# EasyEDA schematic SCH_EasyEDA(立创EDA工程文件).json
TITLE: 双光融合热成像; REV: 1.0; Date: 2026-02-11; Sheet: 1/1; Drawn By: umeko & 野生的攻城狮; Company: UmekoLab
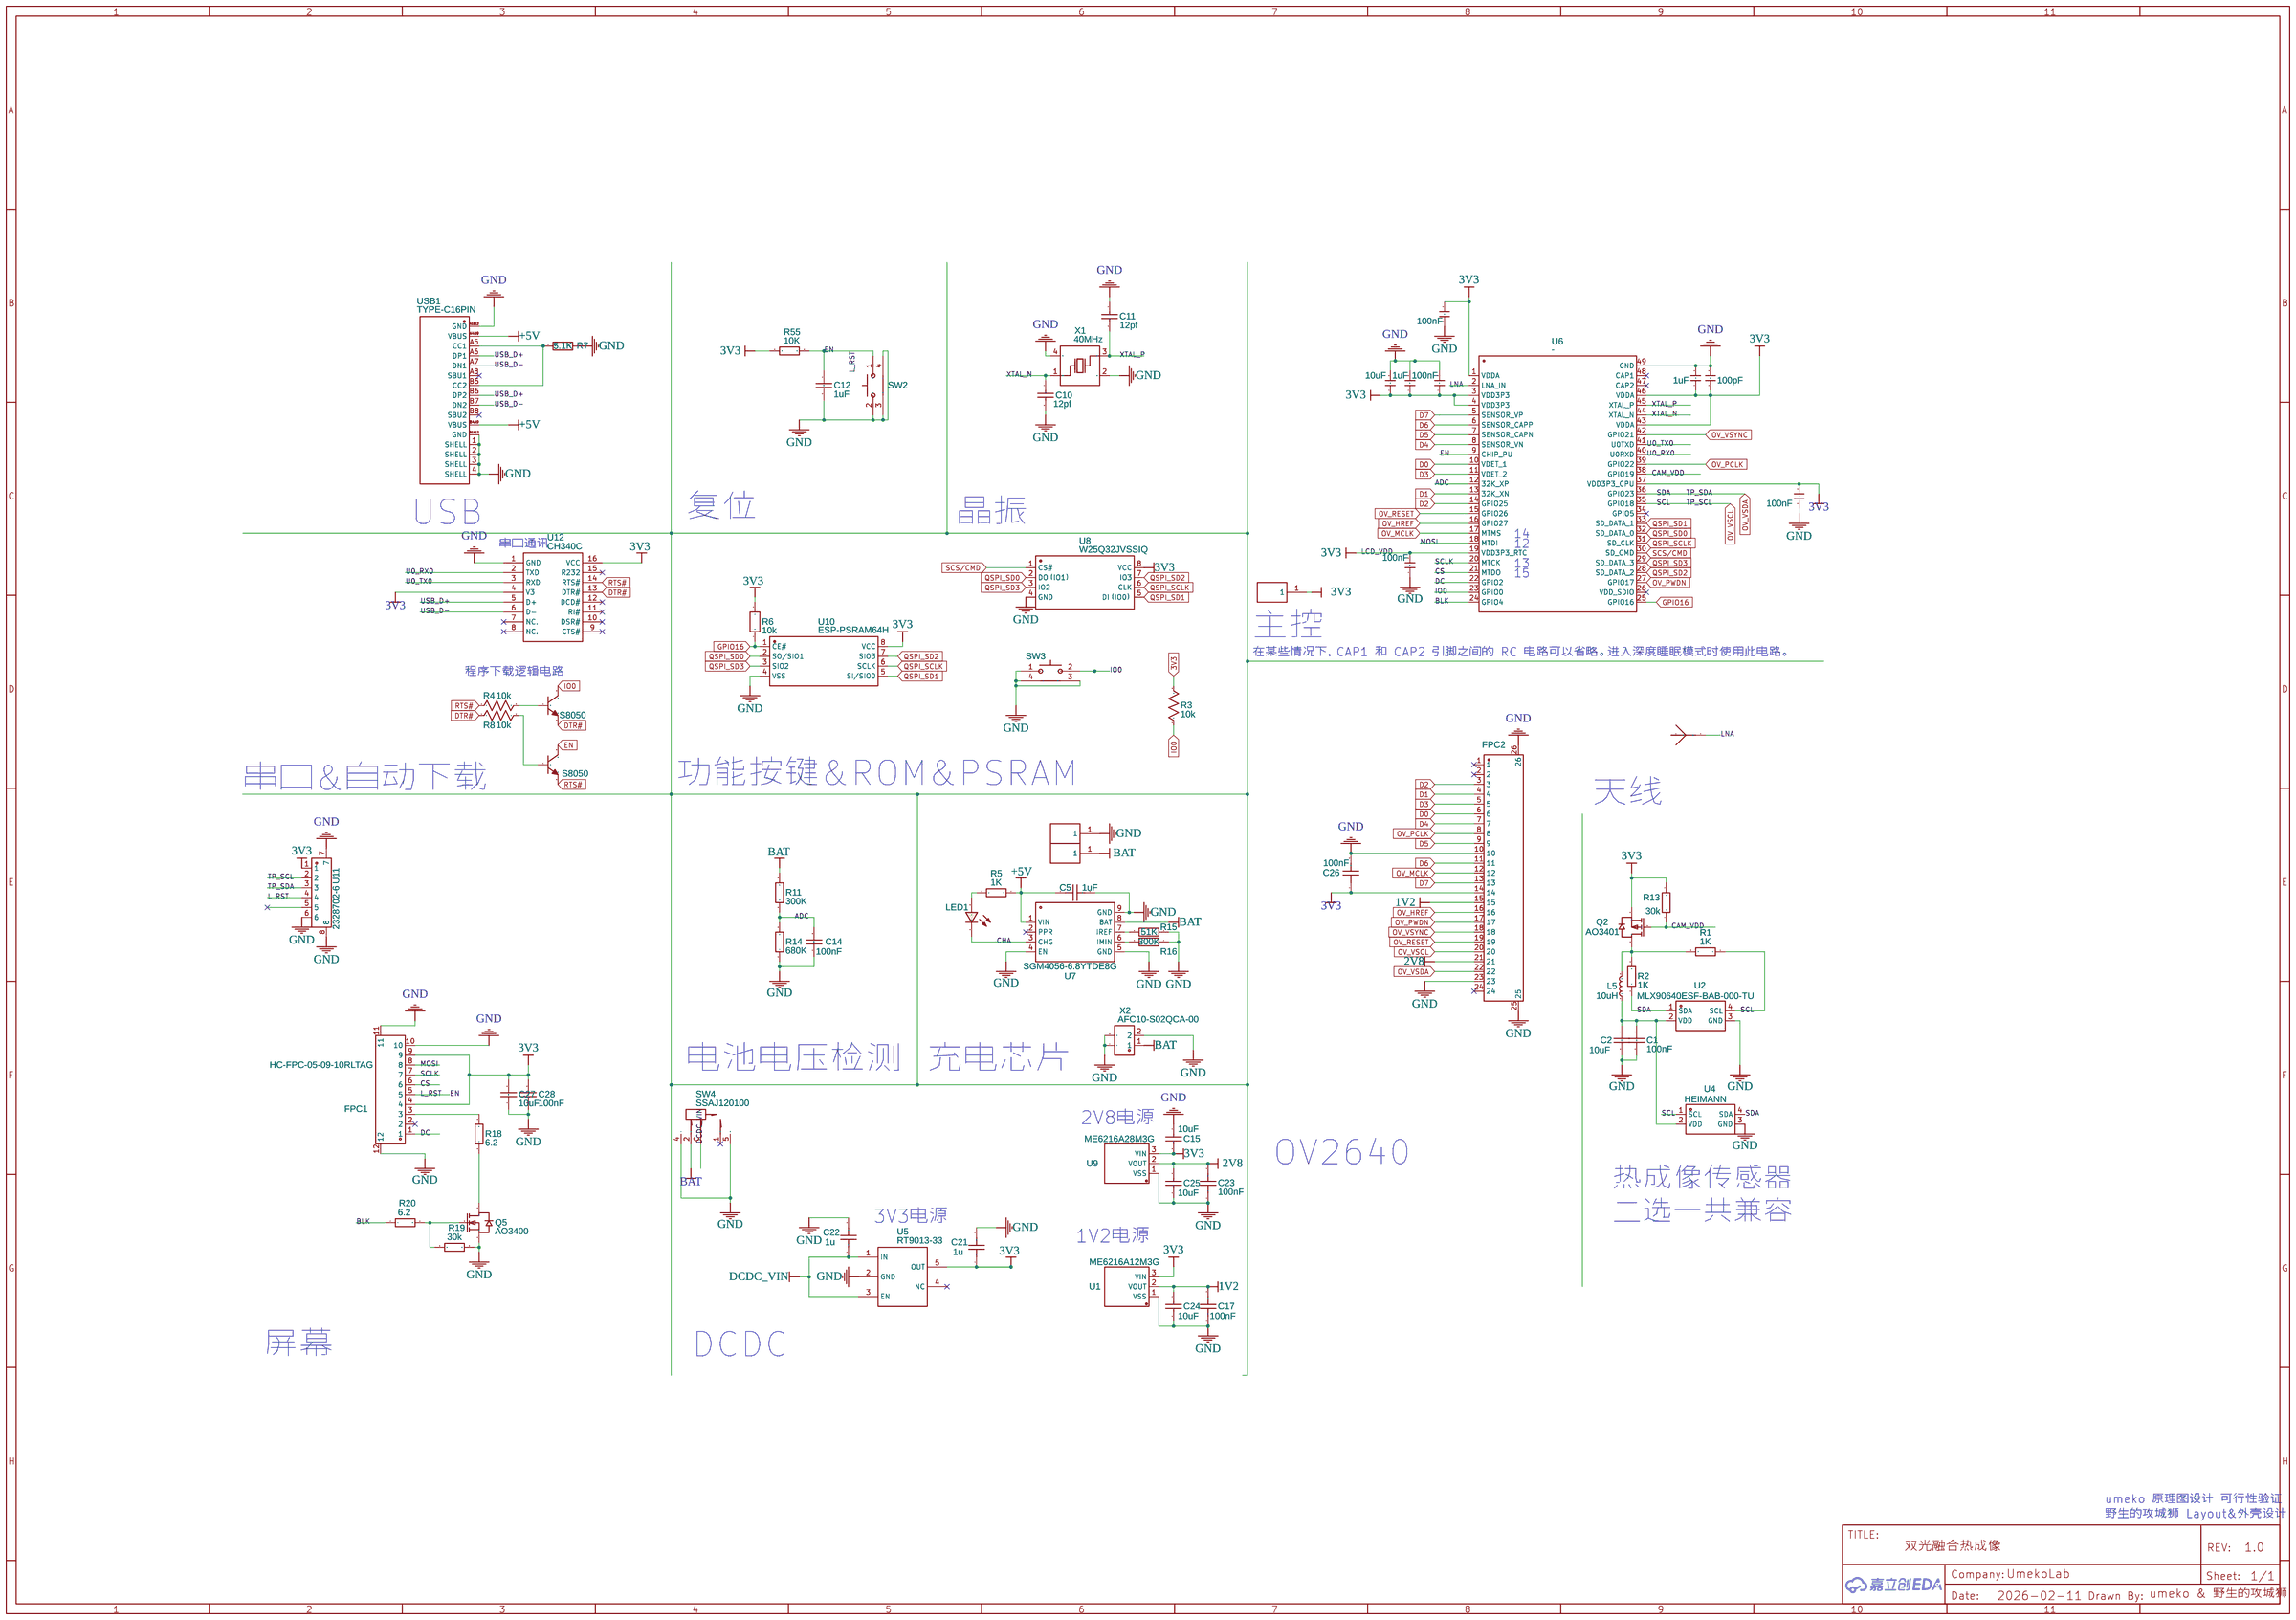
[diagram p0: schematic sheet]

## Parts
C1  100nF  [C0402]
C2  10uF  [C0402]
C5  1uF  [C0402]
C6  1uF  [C0402]
C7  10uF  [C0402]
C8  100nF  [C0402]
C10  12pf  [C0402]
C11  12pf  [C0402]
C12  1uF  [C0402]
C13  100nF  [C0402]
C14  100nF  [C0402]
C15  10uF  [C0402]
C16  1uF  [C0402]
C17  100nF  [C0402]
C18  100pF  [C0402]
C19  100nF  [C0402]
C20  100nF  [C0402]
C21  1u  [C0603]
C22  1u  [C0603]
C23  100nF  [C0402]
C24  10uF  [C0402]
C25  10uF  [C0402]
C26  100nF  [C0402]
C27  10uF  [C0402]
C28  100nF  [C0402]
FPC1  HC-FPC-05-09-10RLTAG  [FPC-SMD_10P-P0.50_HC-FPC-05-09-10RLTAG]
FPC2  AFC24-S24FIA-00  [FPC-SMD_P0.50-24P_QCHF-SM-H2.0]
H1  hp  [HANPAN]
H2  hp  [HANPAN]
H3  hp  [HANPAN]
L2  ANT-PCB-2.4G-IFA-AN043-TI-ORIGIN-X  [ANT-PCB-2.4G-IFA-AN043-TI-ORIGIN]
L5  10uH  [0805-L]
LED1  led-0603  [LED-0603]
Q1  S8050  [SOT-23-3_L2.9-W1.3-P1.90-LS2.4-BR]
Q2  AO3401  [SOT-23-3_L2.9-W1.3-P1.90-LS2.4-BR]
Q4  S8050  [SOT-23-3_L2.9-W1.3-P1.90-LS2.4-BR]
Q5  AO3400  [SOT-23-3_L2.9-W1.4-P1.91-LS2.6-BR]
R1  1K  [R0603]
R2  1K  [R0603]
R3  10k  [R0402]
R4  10k  [R0603]
R5  1K  [R0603]
R6  10k  [R0603]
R7  5.1K  [R0603]
R8  10k  [R0603]
R11  300K  [R0603]
R13  30k  [R0603]
R14  680K  [R0603]
R15  51K  [R0603]
R16  300K  [R0603]
R18  6.2  [R0603]
R19  30k  [R0603]
R20  6.2  [R0603]
R55  10K  [R0603]
SW2  1TS003B  [KEY-SMD_1TS003B]
SW3  1TS003B  [KEY-SMD_1TS003B]
SW4  SSAJ120100  [SW-SMD_SSAJ120100]
U1  ME6216A12M3G  [SOT-23-3_L2.9-W1.6-P1.90-LS2.8-BR]
U2  MLX90640ESF-BAB-000-TU  [TO-39-4_MELEXIS_MLX90640]
U4  HEIMANN  [TO-39-4_MELEXIS_MLX90640]
U5  RT9013-33  [RT9013]
U6  -  [QFN-48_L5.0-W5.0-P0.35-BL-EP3.7]
U7  SGM4056-6.8YTDE8G  [TDFN-8L_L2.0-W2.0-P0.50-BL-EP]
U8  W25Q32JVSSIQ  [SOIC-8_L5.3-W5.3-P1.27-LS8.0-BL]
U9  ME6216A28M3G  [SOT-23-3_L2.9-W1.3-P1.90-LS2.4-BR]
U10  ESP-PSRAM64H  [SOP-8_L4.9-W3.9-P1.27-LS6.0-BL]
U11  2328702-6  [CONN-SMD_6P-P0.50-2328702-6]
U12  CH340C  [SOP-16_L10.0-W3.9-P1.27-LS6.0-BL]
USB1  TYPE-C16PIN  [USB-C-SMD_TYPE-C16PIN]
X1  40MHz  [OSC-SMD_4P-L3.2-W2.5-BL_SIT8008BI]
X2  AFC10-S02QCA-00  [CONN-SMD_AFC10-S02QCA-00]

## Library data of the parts
C1 C2 C5-C8 C12-C14 C16 C18-C20 C27 C28 = cap 0603: Contributor: dhx233
C10 C11 = cap 0402: Contributor: dhx233
C15 C24 C25 = CL05A106MQ5NUNC: Supplier: LCSC; Manufacturer: SAMSUNG; Supplier Part: C15525; JLCPCB Part Class: Basic Part
C17 C23 C26 = CL05B104KB54PNC: Supplier: LCSC; Supplier Part: C307331; Manufacturer: Samsung Electro-Mechanics; Contributor: LCSC; JLCPCB Part Class: Basic Part
C21 C22 = C_0603_US: Contributor: LCEDA_Lib
FPC1 = HC-FPC-05-09-10RLTAG: Contributor: lcsc; Supplier: LCSC; Supplier Part: C5213750; Manufacturer: HCTL(华灿天禄); JLCPCB Part Class: Extended Part
FPC2 = AFC24-S24FIA-00: Supplier: LCSC; Supplier Part: C262683; Manufacturer: JUSHUO; Contributor: LCSC; JLCPCB Part Class: Extended Part
H1-H3 = hp: Contributor: WLFPV
L2 = ANT-PCB-2.4G-IFA-AN043-TI-ORIGIN-X: Supplier: aptchip(爱普特微); Manufacturer: GT; Contributor: fangcheng0122
L5 = 0805-L: Contributor: 启凡科创
LED1 = led-0603: Contributor: 启凡科创官方
Q1 Q4 = S8050_C908252: Supplier: LCSC; Supplier Part: C908252; Manufacturer: FUXINSEMI; Contributor: LCSC; JLCPCB Part Class: Extended Part
Q2 = AO3401_C2848197: Contributor: LCSC; Supplier: LCSC; Supplier Part: C2848197; Manufacturer: IDCHIP(英锐芯); JLCPCB Part Class: Extended Part
Q5 = AO3400_C2848198: Contributor: LCSC; Supplier: LCSC; Supplier Part: C2848198; Manufacturer: IDCHIP(英锐芯); JLCPCB Part Class: Extended Part
R1 R2 R5 R7 R11 R13-R16 R18-R20 R55 = res-0603: Contributor: dhx233
R3 R4 R8 = R_0603_US: Contributor: LCEDA_Lib
R6 = R_0603_EU: Contributor: LCEDA_Lib
SW2 SW3 = 1TS003B-1900-3500A: Contributor: LCSC
SW4 = SSAJ120100: Supplier: LCSC; Supplier Part: C160864; Manufacturer: ALPSALPINE(阿尔卑斯阿尔派); Contributor: LCSC; JLCPCB Part Class: Extended Part
U1 = ME6216A12M3G: Supplier: LCSC; Supplier Part: C236663; Manufacturer: Nanjing Micro One Elec; Contributor: LCSC; JLCPCB Part Class: Extended Part
U2 U4 = MLX90640ESF-BAB-000-TU: Contributor: lcsc
U5 = RT9013-33: Supplier: LCSC; Manufacturer: RICHTEK; Manufacturer Part: RT9013-33GB; image: //image.lceda.cn/szlcsc/C47773.jpg; Supplier Part: C47773; SMT Type: Extend; JLCPCB SMD: Yes; Contributor: oooouuuu
U6 = ESP32-D0WD: Contributor: LCSC; Supplier: LCSC; Supplier Part: C130167; Manufacturer: ESPRESSIF(乐鑫); JLCPCB Part Class: Extended Part
U7 = SGM4056-6.8YTDE8G: Contributor: LCSC
U8 = W25Q32JVSSIQ: Supplier: LCSC; Manufacturer: WINBOND; Supplier Part: C82344; JLCPCB Part Class: Extended Part
U9 = ME6216A28M3G: Supplier: LCSC; Supplier Part: C236658; Manufacturer: Nanjing Micro One Elec; Contributor: LCSC; JLCPCB Part Class: Extended Part
U10 = ESP-PSRAM64H: Contributor: LCSC; Supplier: LCSC; Supplier Part: C2763896; Manufacturer: null; JLCPCB Part Class: Extended Part
U11 = 2328702-6: Contributor: lcsc; Supplier: LCSC; Supplier Part: C3151647; Manufacturer: TE Connectivity(泰科电子); JLCPCB Part Class: Extended Part
U12 = CH340C: Supplier: LCSC; Manufacturer: WCH; Supplier Part: C84681; JLCPCB Part Class: Extended Part
USB1 = TYPE-C16PIN: Supplier: LCSC; Supplier Part: C393939; Manufacturer: SHOU HAN; Contributor: LCSC
X1 = X322540MPB4SI: Supplier: LCSC; Manufacturer: YXC(扬兴晶振); Supplier Part: C9010; JLCPCB Part Class: Extended Part
X2 = AFC10-S02QCA-00: Contributor: LCSC; Supplier: LCSC; Supplier Part: C2764181; Manufacturer: JS(钜硕电子); JLCPCB Part Class: Extended Part

## Nets
1V2: C17.2 C24.1 FPC2.15 U1.2(VOUT)
2V8: C23.2 C25.1 FPC2.21 U9.2(VOUT)
3V3: C6.1 C7.1 C8.1 C13.2 C15.2 C16.1 C18.1 C19.2 C20.2 C21.1 C26.1 C27.1 C28.1 FPC1.4 FPC1.9 FPC2.14 H3.1 Q2.2(S) R3.2 R6.2 R13.2 R55.1 U1.3(VIN) U5.5(OUT) U6.1(VDDA) U6.3(VDD3P3) U6.4(VDD3P3) U6.19(VDD3P3_RTC) U6.37(VDD3P3_CPU) U6.43(VDDA) U6.46(VDDA) U8.8(VCC) U9.3(VIN) U10.8(VCC) U11.1 U12.4(V3) U12.16(VCC)
+5V: C5.1 R5.1 U7.1(VIN) USB1.A4B9(VBUS) USB1.B4A9(VBUS)
GND: C1.2 C2.2 C5.2 C6.2 C7.2 C8.2 C10.2 C11.1 C12.2 C13.1 C14.2 C15.1 C16.2 C17.1 C18.2 C19.1 C20.1 C21.2 C22.2 C23.1 C24.2 C25.2 C26.2 C27.2 C28.2 FPC1.10 FPC1.11 FPC1.12 FPC2.10 FPC2.23 FPC2.25 FPC2.26 H1.1 Q5.2(S) R7.1 R14.1 R15.1 R16.1 R19.2 SW2.2 SW2.3 SW2.4 SW3.1 SW3.3 SW3.4 SW4.4 SW4.5 U1.1(VSS) U2.3(GND) U4.3(GND) U5.2(GND) U6.49(GND) U7.4(EN) U7.5(GND) U7.9(GND) U8.4(GND) U9.1(VSS) U10.4(VSS) U11.6 U11.7 U11.8 U12.1(GND) USB1.1(SHELL) USB1.2(SHELL) USB1.3(SHELL) USB1.4(SHELL) USB1.A1B12(GND) USB1.B1A12(GND) X1.2(GND) X1.4(GND) X2.2 X2.3 X2.4
ADC: C14.1 R11.1 R14.2 U6.12(32K_XP)
BAT: H2.1 R11.2 SW4.2 U7.8(BAT) X2.1
BLK: R20.1 U6.24(GPIO4)
CAM_VDD: Q2.1(G) R13.1 U6.38(GPIO19)
CHA: LED1.1(C) U7.3(CHG)
CS: FPC1.6 U6.21(MTDO)
D0: FPC2.6 U6.10(VDET_1)
D1: FPC2.4 U6.13(32K_XN)
D2: FPC2.3 U6.14(GPIO25)
D3: FPC2.5 U6.11(VDET_2)
D4: FPC2.7 U6.8(SENSOR_VN)
D5: FPC2.9 U6.7(SENSOR_CAPN)
D6: FPC2.11 U6.6(SENSOR_CAPP)
D7: FPC2.13 U6.5(SENSOR_VP)
DC: FPC1.1 U6.22(GPIO2)
DCDC_VIN: C22.1 SW4.C U5.1(IN) U5.3(EN)
DTR#: Q4.2(E) R8.1 U12.13(DTR#)
EN: C12.1 FPC1.5 Q1.3(C) R55.2 SW2.1 U6.9(CHIP_PU) U11.4
GPIO16: R6.1 U6.25(GPIO16) U10.1(CE#)
IO0: Q4.3(C) R3.1 SW3.2 U6.23(GPIO0)
LNA: L2.4(GND) U6.2(LNA_IN)
MOSI: FPC1.8 U6.18(MTDI)
OV_HREF: FPC2.16 U6.16(GPIO27)
OV_MCLK: FPC2.12 U6.17(MTMS)
OV_PCLK: FPC2.8 U6.39(GPIO22)
OV_PWDN: FPC2.17 U6.27(GPIO17)
OV_RESET: FPC2.19 U6.15(GPIO26)
OV_VSCL: FPC2.20 R1.1 U2.4(SCL) U4.1(SCL) U6.35(GPIO18) U11.2
OV_VSDA: FPC2.22 R2.1 U2.1(SDA) U4.4(SDA) U6.36(GPIO23) U11.3
OV_VSYNC: FPC2.18 U6.42(GPIO21)
QSPI_SCLK: U6.31(SD_CLK) U8.6(CLK) U10.6(SCLK)
QSPI_SD0: U6.32(SD_DATA_0) U8.2(DO（IO1）) U10.2(SO/SIO1)
QSPI_SD1: U6.33(SD_DATA_1) U8.5(DI（IO0）) U10.5(SI/SIO0)
QSPI_SD2: U6.28(SD_DATA_2) U8.7(IO3) U10.7(SIO3)
QSPI_SD3: U6.29(SD_DATA_3) U8.3(IO2) U10.3(SIO2)
RTS#: Q1.2(E) R4.1 U12.14(RTS#)
SCLK: FPC1.7 U6.20(MTCK)
SCS/CMD: U6.30(SD_CMD) U8.1(CS#)
U0_RX0: U6.40(U0RXD) U12.2(TXD)
U0_TX0: U6.41(U0TXD) U12.3(RXD)
USB_D+: U12.5(D+) USB1.A6(DP1) USB1.B6(DP2)
USB_D-: U12.6(D-) USB1.A7(DN1) USB1.B7(DN2)
XTAL_N: C10.1 U6.44(XTAL_N) X1.1(OSC1)
XTAL_P: C11.2 U6.45(XTAL_P) X1.3(OSC2)
Net-(C1-1): C1.1 C2.1 L5.1 U2.2(VDD) U4.2(VDD)
Net-(FPC1-3): FPC1.3 R18.2
Net-(L5-2): L5.2 Q2.3(D) R1.2 R2.2
Net-(LED1-2): LED1.2(A) R5.2
Net-(Q1-1): Q1.1(B) R8.2
Net-(Q4-1): Q4.1(B) R4.2
Net-(Q5-1): Q5.1(G) R19.1 R20.2
Net-(Q5-3): Q5.3(D) R18.1
Net-(R7-2): R7.2 USB1.A5(CC1) USB1.B5(CC2)
Net-(R15-2): R15.2 U7.7(IREF)
Net-(R16-2): R16.2 U7.6(IMIN)

Not connected (* = marked no-connect by the designer): FPC1 2*; FPC2 1* 2* 24*; SW4 1*; U5 4(NC)*; U6 26(VDD_SDIO)* 34(GPIO5)* 47(CAP2)* 48(CAP1)*; U7 2(PPR)*; U11 5; U12 7(NC.)* 8(NC.)* 9(CTS#)* 10(DSR#)* 11(RI#)* 12(DCD#)* 15(R232)*; USB1 A8(SBU1)* B8(SBU2)*

## Notes on the sheet
- USB
- 复位
- 晶振
- 14
- 串口通讯
- 12
- 13
- 15
- 主控
- 在某些情况下，CAP1 和 CAP2 引脚之间的 RC 电路可以省略。进入深度睡眠模式时使用此电路。
- 程序下载逻辑电路
- 串口&自动下载
- 功能按键&ROM&PSRAM
- 天线
- 电池电压检测
- 充电芯片
- 2V8电源
- OV2640
- 热成像传感器
  二选一共兼容
- 3V3电源
- 1V2电源
- 屏幕
- DCDC
- umeko 原理图设计 可行性验证
- 野生的攻城狮 Layout&外壳设计
